# EAGLE schematic TIshematic (1) (EAGLE 9.1.0)
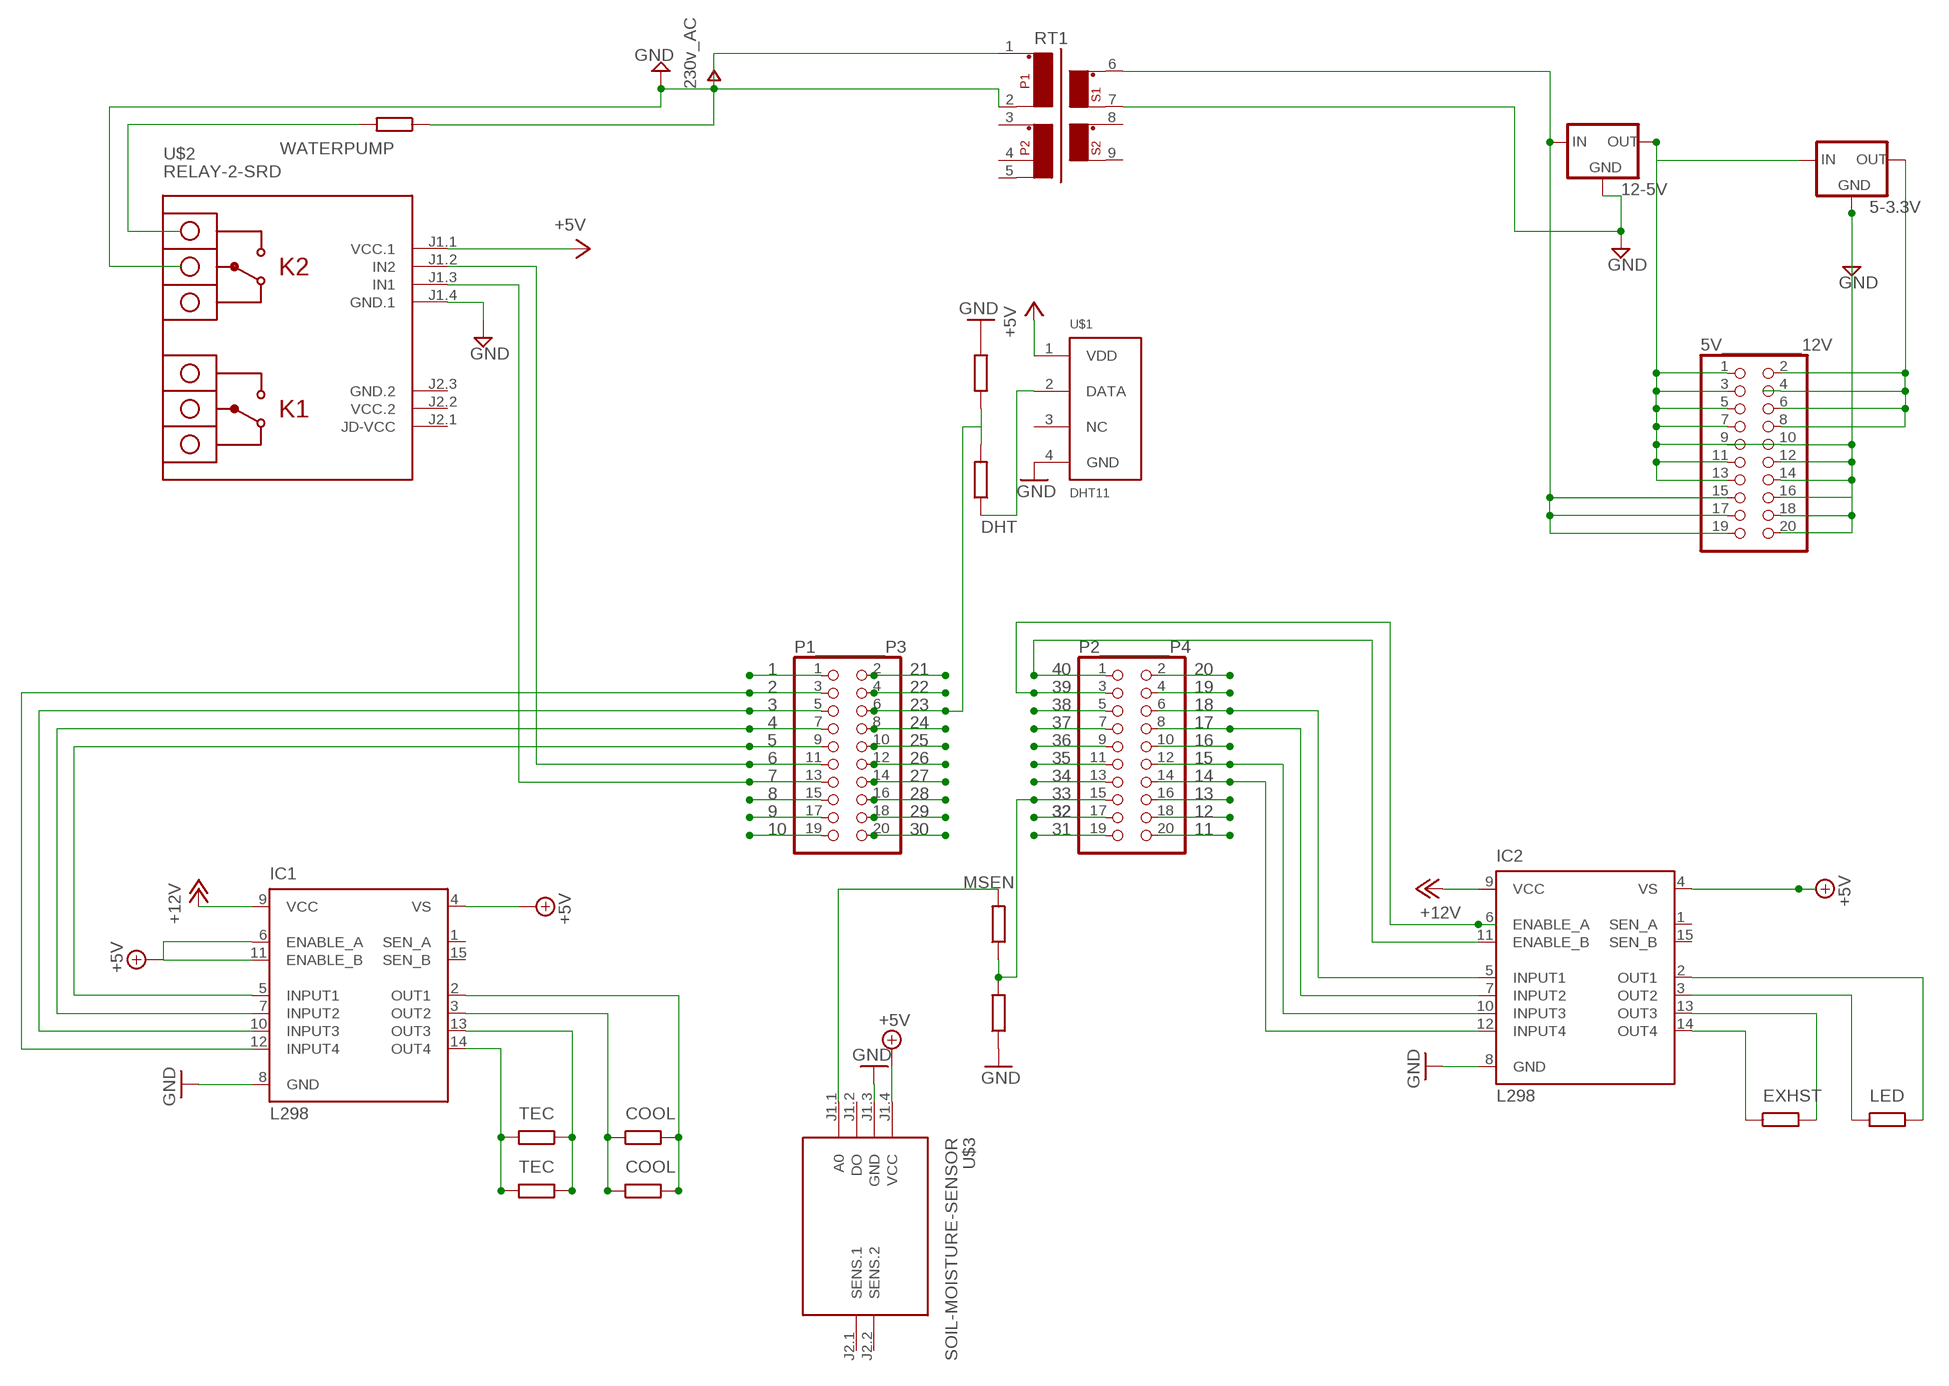
[diagram p0: schematic, sheet 1]

## Parts
5-3.3V  78XXL  [78XXL]
5V________12V  PINHD-2X10  [2X10]
12-5V  78XXL  [78XXL]
IC1  L298  [MULTIWATT-15]
IC2  L298  [MULTIWATT-15]
P1_______P3  PINHD-2X10  [2X10]
P2_______P4  PINHD-2X10  [2X10]
RT1  15VA  [15VA]
U$1  DHT11  [DHT11]
U$2  RELAY-2-SRD  [RELAY-2-SRD]
U$3  SOIL-MOISTURE-SENSOR  [SOIL-MOISTURE-SENSOR]

## Nets
2: IC2.5(INPUT1) IC2.7(INPUT2) P1_______P3.1 P1_______P3.2 P1_______P3.4 P1_______P3.8 P1_______P3.10 P1_______P3.11 P1_______P3.12 P1_______P3.13 P1_______P3.14 P1_______P3.15 P1_______P3.16 P1_______P3.17 P1_______P3.18 P1_______P3.19 P1_______P3.20 P2_______P4.2 P2_______P4.5 P2_______P4.6 P2_______P4.7 P2_______P4.8 P2_______P4.9 P2_______P4.10 P2_______P4.11 P2_______P4.13 P2_______P4.15 P2_______P4.16 P2_______P4.17 P2_______P4.18 P2_______P4.19 P2_______P4.20 U$2.J1.2(IN2) U$2.J1.3(IN1)
40: IC2.11(ENABLE_B) P2_______P4.1
+5V: IC1.4(VS) IC1.6(ENABLE_A) IC1.11(ENABLE_B) IC2.4(VS) U$1.1(VDD) U$2.J1.1(VCC.1) U$3.J1.4(VCC)
+12V: IC1.9(VCC) IC2.9(VCC)
COOL: IC1.3(OUT2)
DHT: P1_______P3.6
EXHST: IC2.14(OUT4)
GND: 5-3.3V.GND 5V________12V.10 5V________12V.12 5V________12V.14 5V________12V.16 5V________12V.18 5V________12V.20 12-5V.GND IC1.8(GND) IC2.8(GND) RT1.1 RT1.2 RT1.7 U$1.4(GND) U$2.J1.4(GND.1) U$3.J1.3(GND)
LED: IC2.3(OUT2)
MSEN: U$3.J1.1(A0)
N$1: P2_______P4.4
N$2: IC2.12(INPUT4) P2_______P4.14
N$3: U$1.2(DATA)
N$4: IC2.13(OUT3)
N$5: IC2.2(OUT1)
N$6: IC1.13(OUT3)
N$7: IC1.12(INPUT4) P1_______P3.3
N$8: IC1.2(OUT1)
N$9: IC1.10(INPUT3) P1_______P3.5
N$10: IC1.7(INPUT2) P1_______P3.7
N$11: IC1.5(INPUT1) P1_______P3.9
N$12: IC2.6(ENABLE_A) P2_______P4.3
N$13: 5-3.3V.IN 5V________12V.1 5V________12V.3 5V________12V.5 5V________12V.7 5V________12V.9 5V________12V.11 5V________12V.13 12-5V.OUT
N$14: IC2.10(INPUT3) P2_______P4.12
N$16: 5V________12V.15 5V________12V.17 5V________12V.19 12-5V.IN RT1.6
N$18: 5-3.3V.OUT 5V________12V.2 5V________12V.4 5V________12V.6 5V________12V.8
TEC: IC1.14(OUT4)
Unconnected: IC1.1(SEN_A) IC1.15(SEN_B) IC2.1(SEN_A) IC2.15(SEN_B) RT1.3 RT1.4 RT1.5 RT1.8 RT1.9 U$1.3(NC) U$2.J2.1(JD-VCC) U$3.J1.2(DO) U$3.J2.1(SENS.1) U$3.J2.2(SENS.2)

## Notes on the sheet
- 1 | 21 | 20
- 2 | 22 | 39 | 19
- 3 | 23 | 38 | 18
- 4 | 24 | 37 | 17
- 5 | 25 | 36 | 16
- 6 | 26 | 35 | 15
- 7 | 27 | 34 | 14
- 8 | 28 | 33 | 13
- 9 | 29 | 32 | 32 | 12
- 10 | 30 | 31 | 11

## Power pins joined to a net without a drawn wire
GND.2: U$2.J2.3(GND.2)
VCC.2: U$2.J2.2(VCC.2)

## Library data of the parts
5-3.3V 12-5V = v-reg:78XXL: VOLTAGE REGULATOR
5V________12V P1_______P3 P2_______P4 = pinhead:PINHD-2X10: PIN HEADER
IC1 IC2 = st-microelectronics:L298: DUAL FULL-BRIDGE DRIVER; MPN: L298N; OC_FARNELL: 1589425; OC_NEWARK: 32M1527
RT1 = trafo:15VA: TRANSFORMER 1 primary windig + 1 primary winding with tap, 2 secondary windings, core ring
U$1 = dht11:DHT11
U$2 = diy-modules:RELAY-2-SRD: 2-Channel Relay Module based on SRD-05VDC-SL-C relays Click here to find device on ebay.com <http://www.ebay.com/sch/two+channel+relay+module+optocoupler+5v>
U$3 = diy-modules:SOIL-MOISTURE-SENSOR: Soil Moisture Sensor Click here to find device on ebay.com <http://www.ebay.com/sch/soil+moisture+sensor+arduino>